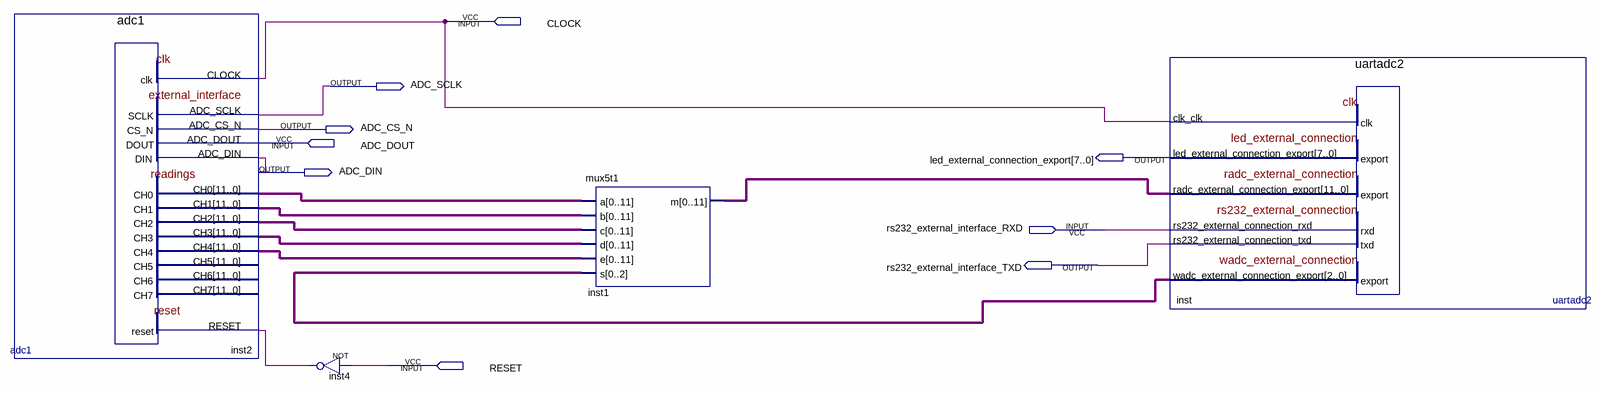
[diagram p0: schematic sheet]
// Quartus schematic top.bdf as structural Verilog: 4 symbols, 9 pins
module top (
  input  CLOCK,
  input  ADC_DOUT,
  input  rs232_external_interface_RXD,
  input  RESET,
  output ADC_SCLK,
  output ADC_CS_N,
  output [7:0] led_external_connection_export,
  output ADC_DIN,
  output rs232_external_interface_TXD
);

  wire inst4_out;
  wire [2:0] inst_wadc_external_connection_export;
  wire [11:0] inst1_m, inst2_ch0, inst2_ch1, inst2_ch2, inst2_ch3, inst2_ch4;

  adc1 inst2 (
    .CLOCK(CLOCK), .ADC_DOUT(ADC_DOUT), .RESET(inst4_out), .ADC_SCLK(ADC_SCLK), .ADC_CS_N(ADC_CS_N),
    .ADC_DIN(ADC_DIN), .CH0(inst2_ch0), .CH1(inst2_ch1), .CH2(inst2_ch2), .CH3(inst2_ch3), .CH4(inst2_ch4));  // open: CH5, CH6, CH7
  not inst4 (inst4_out, RESET);
  mux5t1 inst1 (
    .a(inst2_ch0), .b(inst2_ch1), .c(inst2_ch2), .d(inst2_ch3), .e(inst2_ch4),
    .s(inst_wadc_external_connection_export), .m(inst1_m));
  uartadc2 inst (
    .clk_clk(CLOCK), .radc_external_connection_export(inst1_m),
    .rs232_external_connection_rxd(rs232_external_interface_RXD),
    .led_external_connection_export(led_external_connection_export),
    .rs232_external_connection_txd(rs232_external_interface_TXD),
    .wadc_external_connection_export(inst_wadc_external_connection_export));
endmodule
